# EAGLE schematic PowerboardRev4Con (EAGLE 8.6.0)
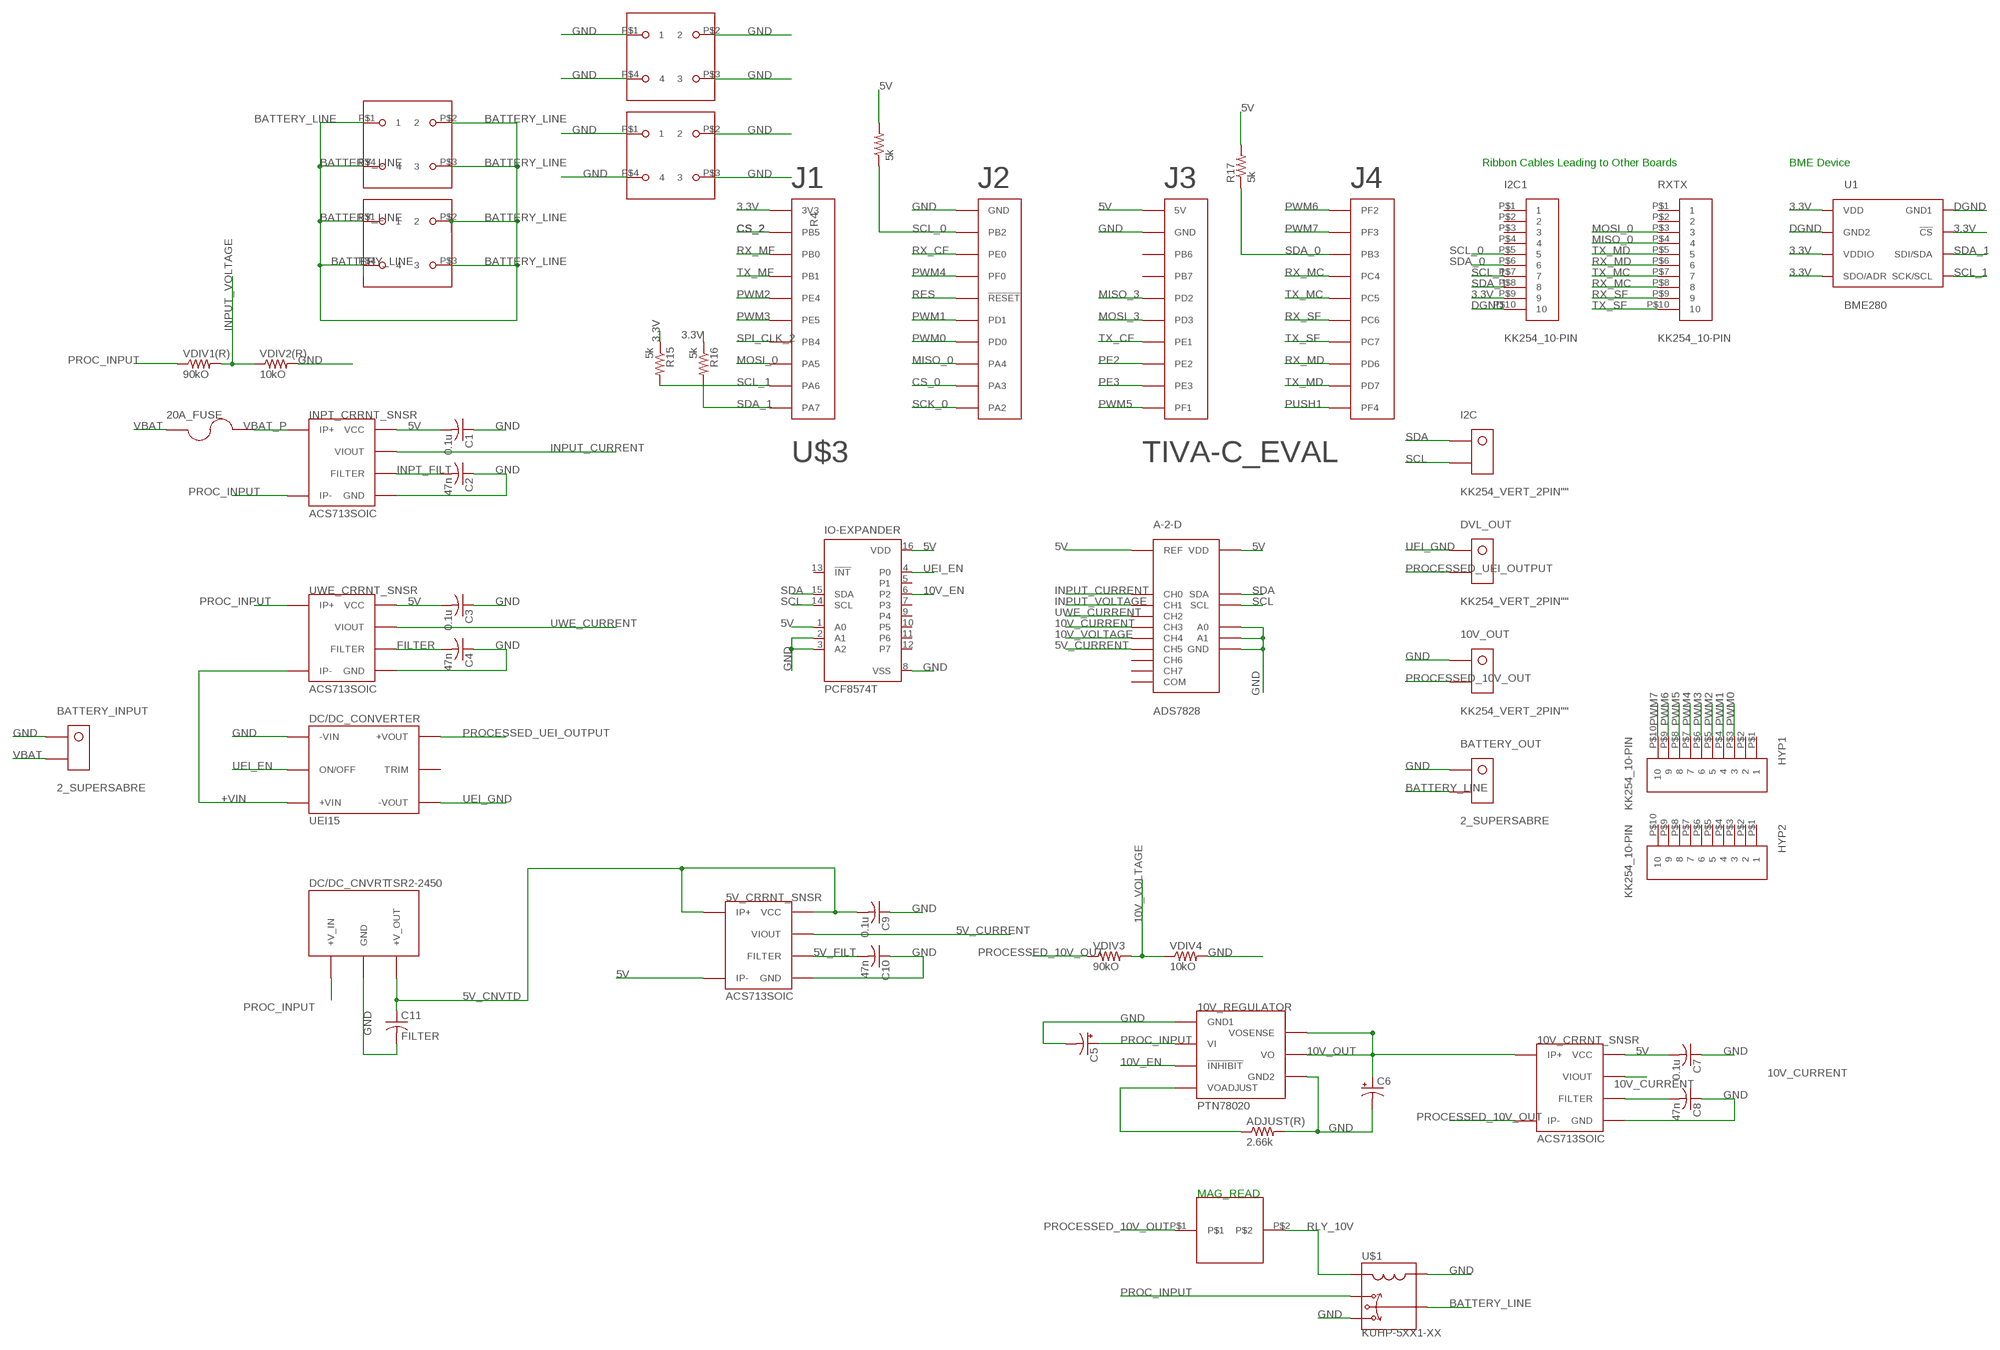
[diagram p0: schematic, sheet 1]

## Parts
5V_CRRNT_SNSR  ACS713SOIC  [ACS713-SOIC]
10V_CRRNT_SNSR  ACS713SOIC  [ACS713-SOIC]
10V_OUT  KK254_VERT_2PIN""  [KK254_VERT_2PIN]
10V_REGULATOR  PTN78020  [PTN]
20A_FUSE  BOWED-1.25"-FUSECLIPS  [1.25"_FUSECLIPS]
A-2-D  ADS7828  [TSSOP16]
ADJUST(R)  2.66k  R-US_R0805  [R0805]
BATTERY_INPUT  2_SUPERSABRE  [SUPERSABRE_2CIRCUIT]
BATTERY_OUT  2_SUPERSABRE  [SUPERSABRE_2CIRCUIT]
C1  0.1u  C-USC0805  [C0805]
C2  47n  C-USC0805  [C0805]
C3  0.1u  C-USC0805  [C0805]
C4  47n  C-USC0805  [C0805]
C5  CPOL-US  [PANASONIC_A_TYPE_M]
C6  CPOL-US  [PANASONIC_A_TYPE_M]
C7  0.1u  C-USC0805  [C0805]
C8  47n  C-USC0805  [C0805]
C9  0.1u  C-USC0805  [C0805]
C10  47n  C-USC0805  [C0805]
C11  FILTER  C-USC0805  [C0805]
DC/DC_CNVRT  TSR2-2450  [TSR2]
DC/DC_CONVERTER  UEI15  [UEI15]
DVL_OUT  KK254_VERT_2PIN""  [KK254_VERT_2PIN]
HYP1  KK254_10-PIN  [KK254_10-PIN]
HYP2  KK254_10-PIN  [KK254_10-PIN]
I2C  KK254_VERT_2PIN""  [KK254_VERT_2PIN]
I2C1  KK254_10-PIN  [KK254_10-PIN]
INPT_CRRNT_SNSR  ACS713SOIC  [ACS713-SOIC]
IO-EXPANDER  PCF8574T  [SO16W]
MAGREAD  HE151TR-ND  [HE151TR-ND]
R4  5k  R-US_R0805  [R0805]
R15  5k  R-US_R0805  [R0805]
R16  5k  R-US_R0805  [R0805]
R17  5k  R-US_R0805  [R0805]
RXTX  KK254_10-PIN  [KK254_10-PIN]
U1  BME280  [BME280_LGA]
U$1  KUHP-5XX1-XX  [KUHP_6.35MM-QUICK-CONNECT]
U$2  BCS-106-L-D-PE-BE  [4-PIN-BIGPOWER]
U$3  TIVA-C_EVAL  [TIVA-C_EVAL]
U$4  BCS-106-L-D-PE-BE  [4-PIN-BIGPOWER]
U$5  BCS-106-L-D-PE-BE  [4-PIN-BIGPOWER]
U$6  BCS-106-L-D-PE-BE  [4-PIN-BIGPOWER]
UWE_CRRNT_SNSR  ACS713SOIC  [ACS713-SOIC]
VDIV1(R)  90kO  R-US_R0805  [R0805]
VDIV2(R)  10kO  R-US_R0805  [R0805]
VDIV3  90kO  R-US_R0805  [R0805]
VDIV4  10kO  R-US_R0805  [R0805]

## Nets
3.3V: I2C1.P$9 R15.1 R16.1 U1.P$2(!CS) U1.P$5(SDO/ADR) U1.P$6(VDDIO) U1.P$8(VDD) U$3.1-1(3V3)
5V: 5V_CRRNT_SNSR.P$3(IP-) 5V_CRRNT_SNSR.P$4(IP-) 10V_CRRNT_SNSR.P$8(VCC) A-2-D.10(REF) A-2-D.16(VDD) C1.2 C3.2 C7.2 INPT_CRRNT_SNSR.P$8(VCC) IO-EXPANDER.1(A0) IO-EXPANDER.16(VDD) R4.2 R17.2 U$3.3-1(5V) UWE_CRRNT_SNSR.P$8(VCC)
5V_CNVTD: 5V_CRRNT_SNSR.P$1(IP+) 5V_CRRNT_SNSR.P$2(IP+) 5V_CRRNT_SNSR.P$8(VCC) C9.2 C11.1 DC/DC_CNVRT.3(+V_OUT)
5V_CURRENT: 5V_CRRNT_SNSR.P$7(VIOUT) A-2-D.6(CH5)
5V_FILT: 5V_CRRNT_SNSR.P$6(FILTER) C10.2
10V_CURRENT: 10V_CRRNT_SNSR.P$7(VIOUT) A-2-D.4(CH3)
10V_EN: 10V_REGULATOR.INHIBIT(!INHIBIT!) IO-EXPANDER.6(P2)
10V_OUT: 10V_CRRNT_SNSR.P$1(IP+) 10V_CRRNT_SNSR.P$2(IP+) 10V_REGULATOR.SENSE(VOSENSE) 10V_REGULATOR.VOUT(VO) C6.+
10V_VOLTAGE: A-2-D.5(CH4) VDIV3.2 VDIV4.1
+VIN: DC/DC_CONVERTER.+VIN UWE_CRRNT_SNSR.P$3(IP-) UWE_CRRNT_SNSR.P$4(IP-)
BATTERY_LINE: BATTERY_OUT.P$2 U$1.7A U$1.7B U$4.P$1 U$4.P$2 U$4.P$3 U$4.P$4 U$5.P$1 U$5.P$2 U$5.P$3
CS_0: U$3.2-9(PA3)
CS_2: U$3.1-2(PB5)
DGND: I2C1.P$10 U1.P$1(GND1) U1.P$7(GND2)
FILTER: C4.2 UWE_CRRNT_SNSR.P$6(FILTER)
FLTR_10V: 10V_CRRNT_SNSR.P$6(FILTER) C8.2
GND: 5V_CRRNT_SNSR.P$5(GND) 10V_CRRNT_SNSR.P$5(GND) 10V_OUT.P$1 10V_REGULATOR.GND1 10V_REGULATOR.GND2 A-2-D.9(GND) A-2-D.12(A0) A-2-D.13(A1) ADJUST(R).2 BATTERY_INPUT.P$1 BATTERY_OUT.P$1 C1.1 C2.1 C3.1 C4.1 C5.- C6.- C7.1 C8.1 C9.1 C10.1 C11.2 DC/DC_CNVRT.2(GND) DC/DC_CONVERTER.-VIN INPT_CRRNT_SNSR.P$5(GND) IO-EXPANDER.2(A1) IO-EXPANDER.3(A2) IO-EXPANDER.8(VSS) U$1.5A U$1.5B U$1.AA(A) U$1.AB(A) U$2.P$1 U$2.P$2 U$2.P$3 U$2.P$4 U$3.2-1(GND) U$3.3-2(GND) U$6.P$1 U$6.P$2 U$6.P$3 U$6.P$4 UWE_CRRNT_SNSR.P$5(GND) VDIV2(R).2 VDIV4.2
INPT_FILT: C2.2 INPT_CRRNT_SNSR.P$6(FILTER)
INPUT_CURRENT: A-2-D.1(CH0) INPT_CRRNT_SNSR.P$7(VIOUT)
INPUT_VOLTAGE: A-2-D.2(CH1) VDIV1(R).2 VDIV2(R).1
MISO_0: RXTX.P$4 U$3.2-8(PA4)
MISO_3: U$3.3-5(PD2)
MOSI_0: RXTX.P$3 U$3.1-8(PA5)
MOSI_3: U$3.3-6(PD3)
N$5: 10V_REGULATOR.ADJUST(VOADJUST) ADJUST(R).1
PE2: U$3.3-8(PE2)
PE3: U$3.3-9(PE3)
PROC_INPUT: 10V_REGULATOR.VIN(VI) C5.+ DC/DC_CNVRT.1(+V_IN) INPT_CRRNT_SNSR.P$3(IP-) INPT_CRRNT_SNSR.P$4(IP-) U$1.2A U$1.2B UWE_CRRNT_SNSR.P$1(IP+) UWE_CRRNT_SNSR.P$2(IP+) VDIV1(R).1
PROCESSED_10V_OUT: 10V_CRRNT_SNSR.P$3(IP-) 10V_CRRNT_SNSR.P$4(IP-) 10V_OUT.P$2 MAGREAD.P$1 VDIV3.1
PROCESSED_UEI_OUTPUT: DC/DC_CONVERTER.+VOUT DVL_OUT.P$2
PUSH1: U$3.4-10(PF4)
PWM0: HYP1.P$3 U$3.2-7(PD0)
PWM1: HYP1.P$4 U$3.2-6(PD1)
PWM2: HYP1.P$5 U$3.1-5(PE4)
PWM3: HYP1.P$6 U$3.1-6(PE5)
PWM4: HYP1.P$7 U$3.2-4(PF0)
PWM5: HYP1.P$8 U$3.3-10(PF1)
PWM6: HYP1.P$9 U$3.4-1(PF2)
PWM7: HYP1.P$10 U$3.4-2(PF3)
RES: U$3.2-5(!RESET!)
RLY_10V: MAGREAD.P$2 U$1.BA(B) U$1.BB(B)
RX_CF: U$3.2-3(PE0)
RX_MC: RXTX.P$8 U$3.4-4(PC4)
RX_MD: RXTX.P$6 U$3.4-8(PD6)
RX_MF: U$3.1-3(PB0)
RX_SF: RXTX.P$9 U$3.4-6(PC6)
SCK_0: U$3.2-10(PA2)
SCL: A-2-D.14(SCL) I2C.P$2 IO-EXPANDER.14(SCL)
SCL_0: I2C1.P$5 R4.1 U$3.2-2(PB2)
SCL_1: I2C1.P$7 R15.2 U1.P$4(SCK/SCL) U$3.1-9(PA6)
SDA: A-2-D.15(SDA) I2C.P$1 IO-EXPANDER.15(SDA)
SDA_0: I2C1.P$6 R17.1 U$3.4-3(PB3)
SDA_1: I2C1.P$8 R16.2 U1.P$3(SDI/SDA) U$3.1-10(PA7)
SPI_CLK_2: U$3.1-7(PB4)
TX_CF: U$3.3-7(PE1)
TX_MC: RXTX.P$7 U$3.4-5(PC5)
TX_MD: RXTX.P$5 U$3.4-9(PD7)
TX_MF: U$3.1-4(PB1)
TX_SF: RXTX.P$10 U$3.4-7(PC7)
UEI_EN: DC/DC_CONVERTER.ON/OFFCNTRL(ON/OFF) IO-EXPANDER.4(P0)
UEI_GND: DC/DC_CONVERTER.-VOUT DVL_OUT.P$1
UWE_CURRENT: A-2-D.3(CH2) UWE_CRRNT_SNSR.P$7(VIOUT)
VBAT: 20A_FUSE.P$1 20A_FUSE.P$2 BATTERY_INPUT.P$2
VBAT_P: 20A_FUSE.P$3 20A_FUSE.P$4 INPT_CRRNT_SNSR.P$1(IP+) INPT_CRRNT_SNSR.P$2(IP+)
Unconnected: A-2-D.7(CH6) A-2-D.8(CH7) A-2-D.11(COM) DC/DC_CONVERTER.OTPTTRIM(TRIM) HYP1.P$1 HYP1.P$2 HYP2.P$1 HYP2.P$2 HYP2.P$3 HYP2.P$4 HYP2.P$5 HYP2.P$6 HYP2.P$7 HYP2.P$8 HYP2.P$9 HYP2.P$10 I2C1.P$1 I2C1.P$2 I2C1.P$3 I2C1.P$4 IO-EXPANDER.5(P1) IO-EXPANDER.7(P3) IO-EXPANDER.9(P4) IO-EXPANDER.10(P5) IO-EXPANDER.11(P6) IO-EXPANDER.12(P7) IO-EXPANDER.13(!INT) RXTX.P$1 RXTX.P$2 U$3.3-3(PB6) U$3.3-4(PB7) U$5.P$4

## Notes on the sheet
- Ribbon Cables Leading to Other Boards | BME Device
- MAG_READ

## Library data of the parts
5V_CRRNT_SNSR 10V_CRRNT_SNSR INPT_CRRNT_SNSR UWE_CRRNT_SNSR = allegro:ACS713
10V_OUT DVL_OUT I2C = molex:KK254_VERT_2PIN: KK® 254 Wire-to-Board Header, Vertical, with Friction Lock, 2 Circuits, Gold (Au) Plating Part Number: 22-29-2021 http://www.molex.com/molex/products/datasheet.jsp?part=active/0022292021_PCB_HEADERS.xml
10V_REGULATOR = texas:PTN
20A_FUSE = littelfuse:BOWED-1.25"-FUSECLIPS: Littelfuse 1.25" fuse clips with bowed leads
A-2-D = texas:ADS7828: Texas Instruments ADS7828 8-channel 12-bit I2C ADC Datasheet <http://www.ti.com/lit/ds/symlink/ads7828.pdf>
ADJUST(R) R4 R15-R17 VDIV1(R) VDIV2(R) VDIV3 VDIV4 = resistor:R-US_: RESISTOR, American symbol
BATTERY_INPUT BATTERY_OUT = molex:2_SUPERSABRE: Molex SuperSabre 2-pin vertical header
C1-C4 C7-C11 = resistor:C-US: CAPACITOR, American symbol
C5 C6 = resistor:CPOL-US: POLARIZED CAPACITOR, American symbol
DC/DC_CNVRT = tracoPower:TSR2-2450: The RSR2-2450 is a DC/DC Converter. https://www.mouser.com/ds/2/687/tsr2-datasheet-911338.pdf
DC/DC_CONVERTER = murata:UEI15: The Murata UEI15 is an isolated wide input range 15W DC/DC Converter https://power.murata.com/data/power/mdc_uei-15w.pdf
HYP1 HYP2 I2C1 RXTX = molex:KK254_10-PIN: KK254 10-pin Datasheet <http://www.molex.com/molex/products/datasheet.jsp?part=active/0022102101_PCB_HEADERS.xml>
IO-EXPANDER = texas:PCF8574: I2C-Bus Remote 8-bit I/O expander http://www.semiconductors.philips.com/acrobat_download/datasheets/PCF8574_4.pdf; MPN: PCF8574T/3,512; OC_FARNELL: 1201255; OC_NEWARK: 70R6870
MAGREAD = magReed:HE151TR-ND
U1 = BME280ComponentLibrary:BME280; PROD_ID: IC-13090
U$1 = TE:KUHP-5XX1-XX: TE Connectivity KUHP-Series Relay Panel relays with quick-connect terminals Relay Datasheet <http://www.mouser.com/ds/2/418/NG_DS_1308242_KUHP_0914_KUHP_0914-713261.pdf> IMPORTANT NOTE: This part is designed using female PCB-mount spade terminals. Part: Keystone Electronics 0.25"x0.032" PC quick-fit terminals (Part No. 3528). Datasheet <http://www.mouser.com/ds/2/215/528-745365.pdf>
U$2 U$4-U$6 = samtec:BCS-106-L-D-PE-BE
U$3 = texas:TIVA-C_EVAL: Texas Instruments Tiva-C TM4C123G LaunchPad Evaluation Board Part number EK-TM4C123GXL Datasheet <http://www.ti.com/lit/ug/spmu296/spmu296.pdf> Microcontroller <http://www.ti.com/lit/ds/spms376e/spms376e.pdf>